# EAGLE design xbee_pines (EAGLE 5.04)
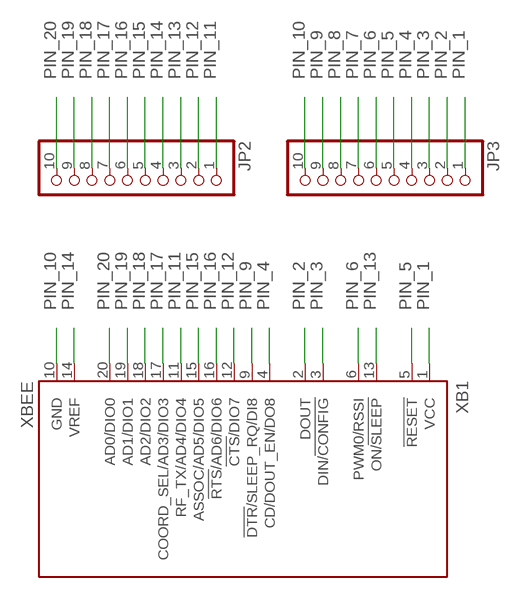
[diagram p0: schematic, sheet 1]

## Parts
JP2  PINHD-1X10  [1X10]
JP3  PINHD-1X10  [1X10]
XB1  XBEE  [XBEE]

## Nets
PIN_1: JP3.1 XB1.1(VCC)
PIN_2: JP3.2 XB1.2(DOUT)
PIN_3: JP3.3 XB1.3(DIN/!CONFIG)
PIN_4: JP3.4 XB1.4(CD/DOUT_EN/DO8)
PIN_5: JP3.5 XB1.5(!RESET)
PIN_6: JP3.6 XB1.6(PWM0/RSSI)
PIN_7: JP3.7
PIN_8: JP3.8
PIN_9: JP3.9 XB1.9(!DTR!/SLEEP_RQ/DI8)
PIN_10: JP3.10 XB1.10(GND)
PIN_11: JP2.1 XB1.11(RF_TX/AD4/DIO4)
PIN_12: JP2.2 XB1.12(!CTS!/DIO7)
PIN_13: JP2.3 XB1.13(ON/!SLEEP)
PIN_14: JP2.4 XB1.14(VREF)
PIN_15: JP2.5 XB1.15(ASSOC/AD5/DIO5)
PIN_16: JP2.6 XB1.16(!RTS!/AD6/DIO6)
PIN_17: JP2.7 XB1.17(COORD_SEL/AD3/DIO3)
PIN_18: JP2.8 XB1.18(AD2/DIO2)
PIN_19: JP2.9 XB1.19(AD1/DIO1)
PIN_20: JP2.10 XB1.20(AD0/DIO0)

## Library data of the parts
JP2 JP3 = pinhead:PINHD-1X10: PIN HEADER
XB1 = maxstream:XBEE: XBee (TM) /XBee-PRO(TM) OEM RF Modules Source: MaxStream, Inc. xbee_productmanual.pdf

## Board
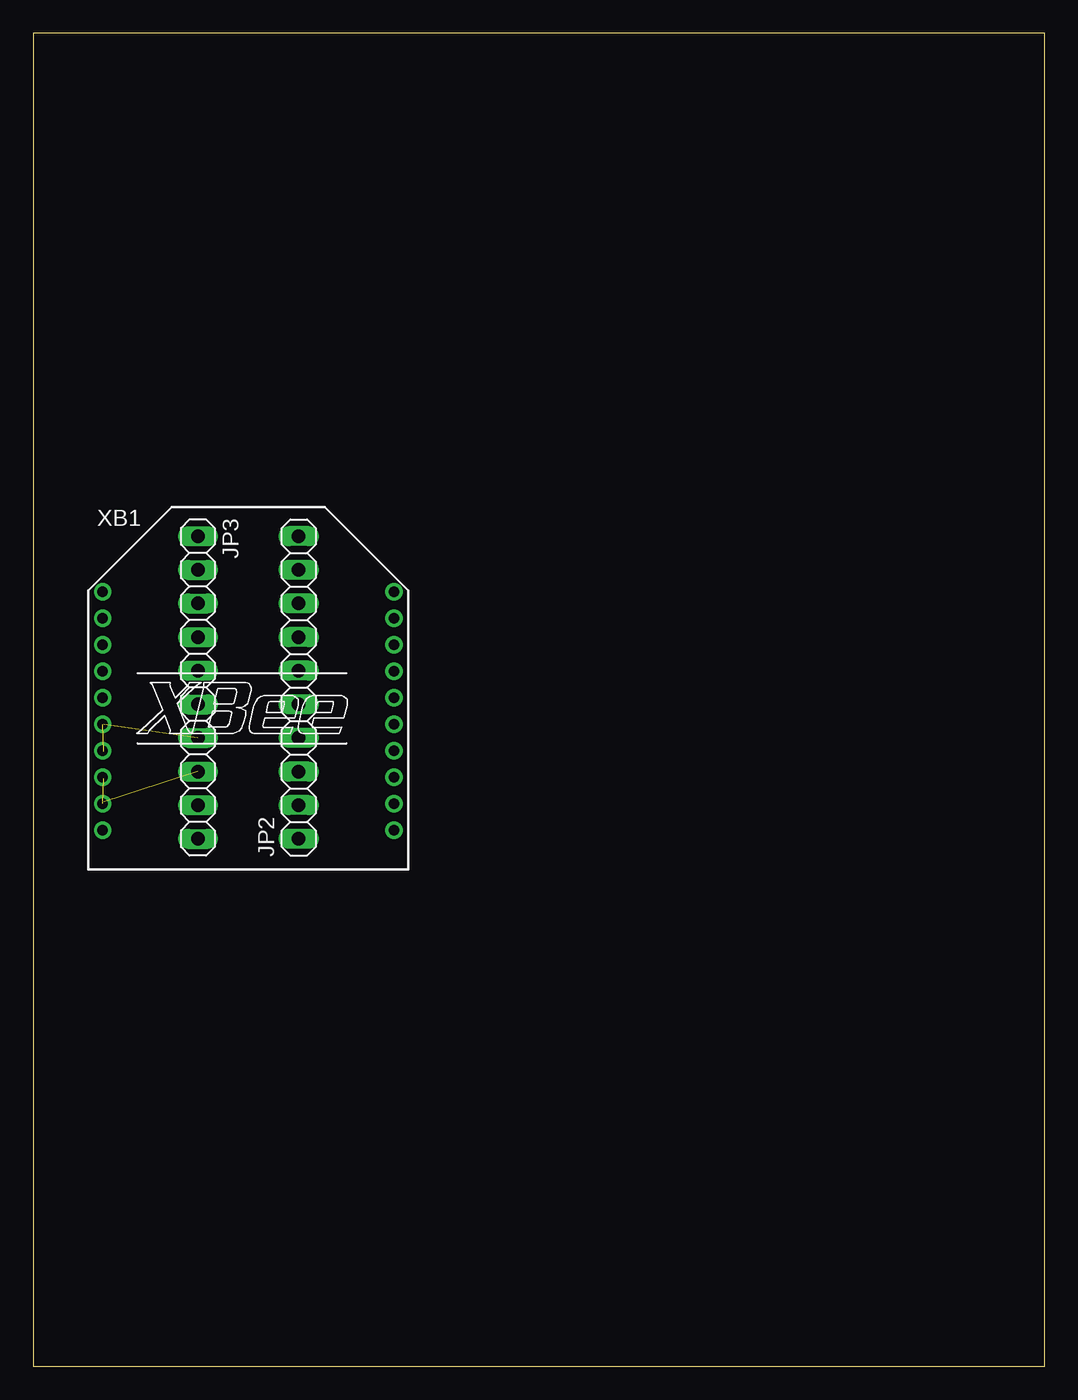
[diagram p1: board, top side]
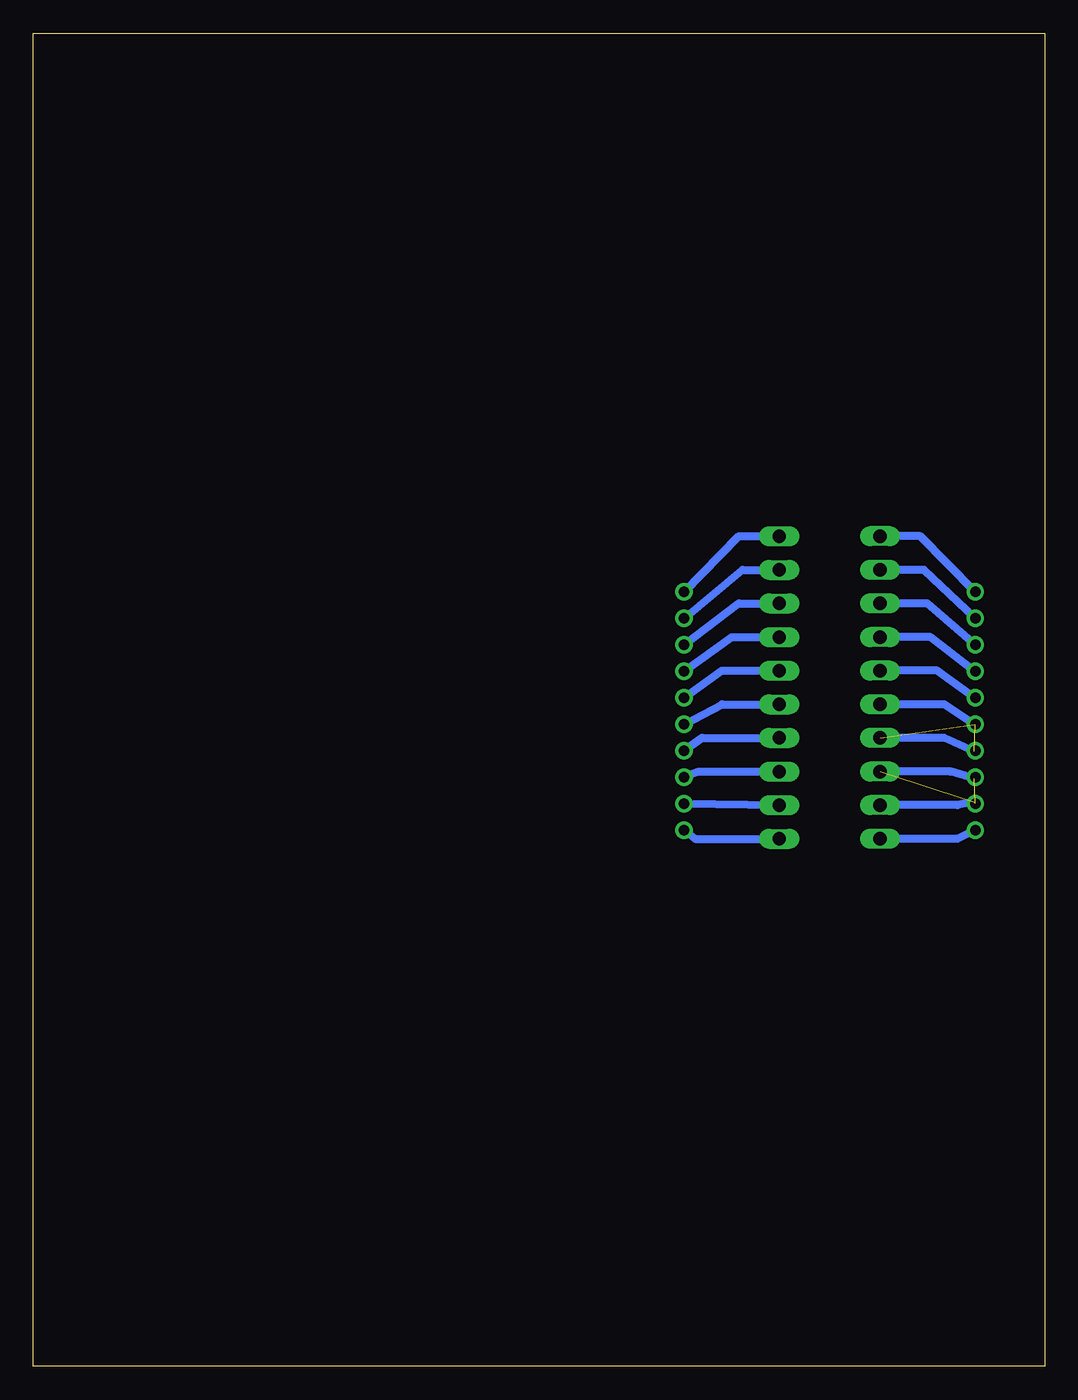
[diagram p2: board, bottom side, seen from below]

Size 76.43 x 100.76 mm. Coordinates in mm from the lower left corner, seen from the top.
Outline: 0,0 76.43,0 76.43,100.76 0,100.76 0,0
Copper layers (1*16): Top 0.035mm / dielectric 1.5mm / Bottom 0.035mm
Design rules "default": minimum track width 10mil, minimum drill 24mil, track to track 8mil, track to pad 8mil, pad to pad 8mil, via to via 8mil, smd to smd 8mil, copper to edge 40mil, drill to drill 8mil, minimum pad ring 10mil, minimum via ring 8mil, stop-mask expansion 4mil, vias tented up to drill 0mil, thermal gap 10mil

### Footprints (pad centres in the part's own frame; a part is rotated, then mirrored left to right if it is on the bottom)
1X10 = drill 1.016 long: 1 -11.43,0; 2 -8.89,0; 3 -6.35,0; 4 -3.81,0; 5 -1.27,0; 6 1.27,0; 7 3.81,0; 8 6.35,0; 9 8.89,0; 10 11.43,0
XBEE = drill 0.8 pad 1.27 round: 1 -11,9; 2 -11,7; 3 -11,5; 4 -11,3; 5 -11,1; 6 -11,-1; 7 -11,-3; 8 -11,-5; 9 -11,-7; 10 -11,-9; 11 11,-9; 12 11,-7; 13 11,-5; 14 11,-3; 15 11,-1; 16 11,1; 17 11,3; 18 11,5; 19 11,7; 20 11,9

### Placement (x,y rotation side)
JP2  20.07,51.31 90 top
JP3  12.45,51.31 270 top
XB1  16.26,49.53 0 top

### Tracks (layer width: path | path; a pad name or v marks a point on that pad's centre or on a via)
PIN_1
  Bottom 0.61: XB1.1 9.4,62.74 JP3.1
PIN_2
  Bottom 0.61: XB1.2 9.14,60.2 JP3.2
PIN_3
  Bottom 0.61: XB1.3 8.89,57.66 JP3.3
PIN_4
  Bottom 0.61: XB1.4 8.64,55.12 JP3.4
PIN_5
  Bottom 0.61: XB1.5 8.13,52.58 JP3.5
PIN_6  (2 unrouted)
  Bottom 0.61: 5.33,46.48 7.62,47.5 12.45,47.5 | 5.33,48.51 7.62,50.04 JP3.6
PIN_9  (2 unrouted)
  Bottom 0.61: 5.33,44.45 7.11,44.96 12.45,44.96 | 5.33,42.67 6.6,42.42 JP3.9
PIN_10
  Bottom 0.61: XB1.10 6.6,39.88 JP3.10
PIN_11
  Bottom 0.61: XB1.11 26.42,39.88 JP2.1
PIN_12
  Bottom 0.61: XB1.12 JP2.2
PIN_13
  Bottom 0.61: XB1.13 26.16,44.96 JP2.3
PIN_14
  Bottom 0.61: XB1.14 25.91,47.5 JP2.4
PIN_15
  Bottom 0.61: XB1.15 24.38,50.04 JP2.5
PIN_16
  Bottom 0.61: XB1.16 24.38,52.58 JP2.6
PIN_17
  Bottom 0.61: XB1.17 23.62,55.12 JP2.7
PIN_18
  Bottom 0.61: XB1.18 23.11,57.66 JP2.8
PIN_19
  Bottom 0.61: XB1.19 22.86,60.2 JP2.9
PIN_20
  Bottom 0.61: XB1.20 23.11,62.74 JP2.10